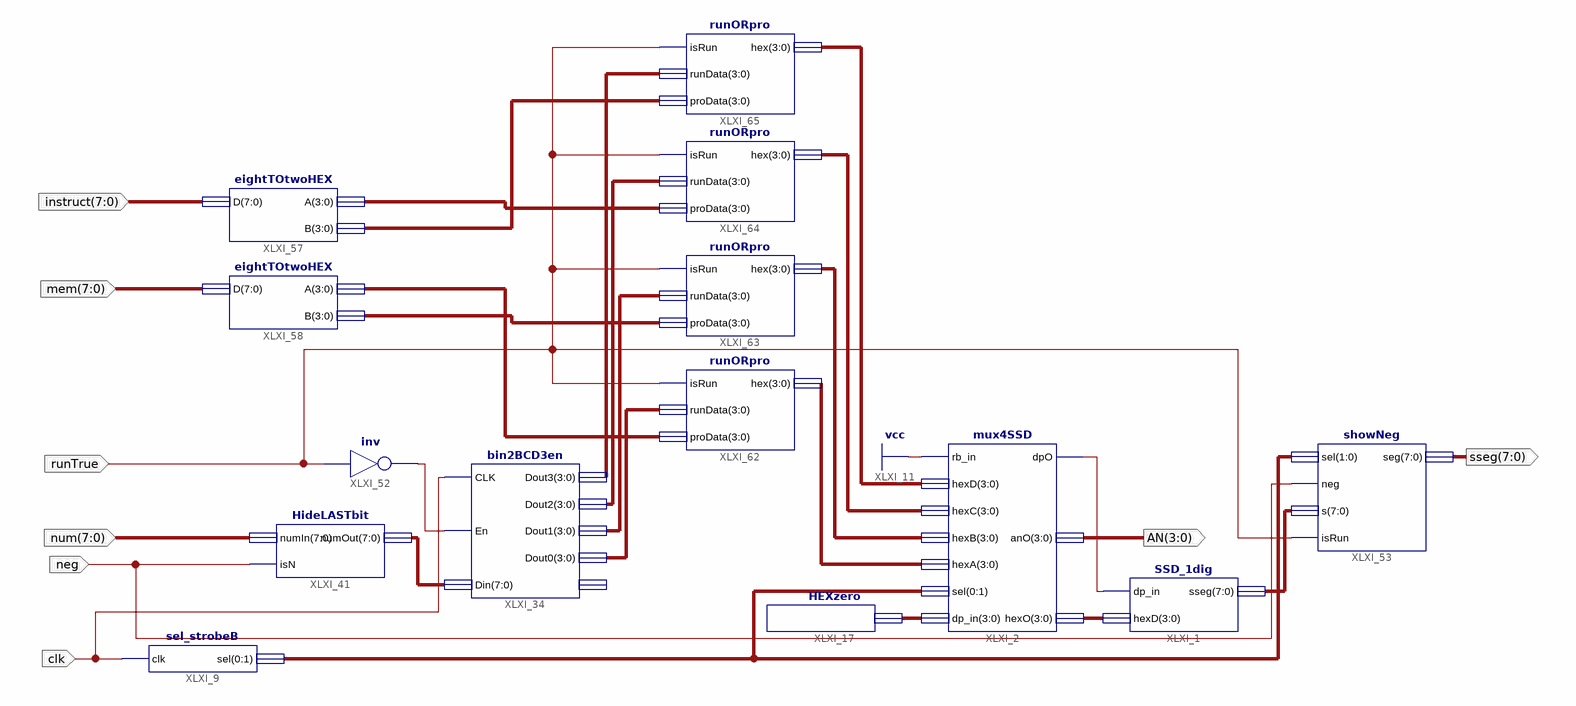
[diagram p0: schematic sheet 1]
// Xilinx ISE schematic display.sch (spartan3e) as structural Verilog: 14 symbols, 8 ports
module display (
  input  neg,
  input  [7:0] num,
  input  clk,
  input  runTrue,
  input  [7:0] mem,
  input  [7:0] instruct,
  output [3:0] AN,
  output [7:0] sseg
);

  wire XLXN_17, XLXN_216;
  wire [1:0] XLXN_196;
  wire [3:0] XLXN_6, XLXN_77, XLXN_244, XLXN_246, XLXN_247, XLXN_248, XLXN_253, XLXN_254, XLXN_255, XLXN_256,
       XLXN_257, XLXN_258, XLXN_259, XLXN_260;
  wire [7:0] XLXN_160, XLXN_234;

  SSD_1dig XLXI_1 (.dp_in(XLXN_17), .hexD(XLXN_6), .sseg(XLXN_234));
  mux4SSD XLXI_2 (
    .rb_in(1'b1), .hexD(XLXN_256), .hexC(XLXN_255), .hexB(XLXN_254), .hexA(XLXN_253),
    .sel({XLXN_196[0], XLXN_196[1]}), .dp_in(XLXN_77), .dpO(XLXN_17), .anO(AN), .hexO(XLXN_6));
  bin2BCD3en XLXI_34 (
    .CLK(clk), .En(XLXN_216), .Din(XLXN_160), .Dout3(XLXN_244), .Dout2(XLXN_246), .Dout1(XLXN_247),
    .Dout0(XLXN_248));  // open: RBout
  HEXzero XLXI_17 (.hexZ(XLXN_77));
  sel_strobeB XLXI_9 (.clk(clk), .sel({XLXN_196[0], XLXN_196[1]}));
  HideLASTbit XLXI_41 (.numIn(num), .isN(neg), .numOut(XLXN_160));
  not XLXI_52 (XLXN_216, runTrue);
  showNeg XLXI_53 (.neg(neg), .sel({XLXN_196[0], XLXN_196[1]}), .s(XLXN_234), .seg(sseg), .isRun(runTrue));
  eightTOtwoHEX XLXI_58 (.D(mem), .A(XLXN_258), .B(XLXN_257));
  eightTOtwoHEX XLXI_57 (.D(instruct), .A(XLXN_260), .B(XLXN_259));
  runORpro XLXI_62 (.isRun(runTrue), .runData(XLXN_248), .proData(XLXN_258), .hex(XLXN_253));
  runORpro XLXI_63 (.isRun(runTrue), .runData(XLXN_247), .proData(XLXN_257), .hex(XLXN_254));
  runORpro XLXI_64 (.isRun(runTrue), .runData(XLXN_246), .proData(XLXN_260), .hex(XLXN_255));
  runORpro XLXI_65 (.isRun(runTrue), .runData(XLXN_244), .proData(XLXN_259), .hex(XLXN_256));
endmodule
